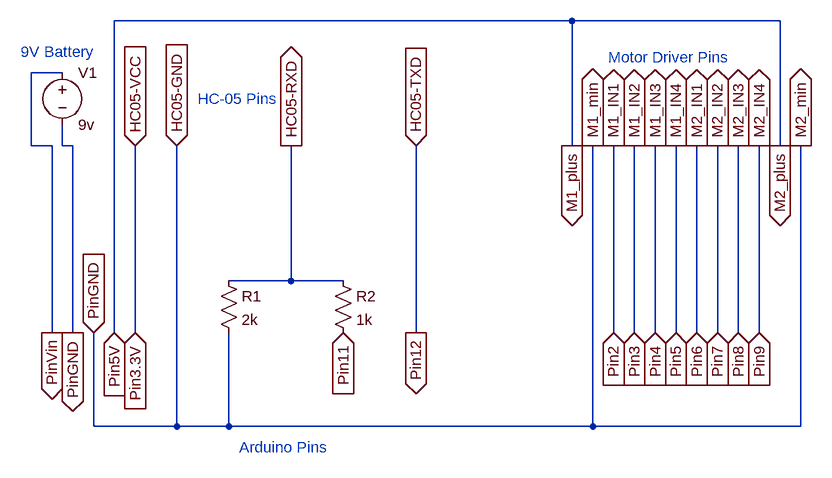
[diagram p0: schematic Schema.asc]
Schema.asc, the LTspice schematic file:
Version 4
SHEET 1 1080 680
WIRE 624 -304 -80 -304
WIRE 944 -304 624 -304
WIRE -160 -224 -208 -224
WIRE -208 -112 -208 -224
WIRE -176 -112 -208 -112
WIRE -160 -112 -160 -144
WIRE -144 -112 -160 -112
WIRE 624 -112 624 -304
WIRE 944 -112 944 -304
WIRE 192 96 192 -112
WIRE 192 96 96 96
WIRE 272 96 192 96
WIRE -176 176 -176 -112
WIRE -144 176 -144 -112
WIRE -80 176 -80 -304
WIRE -48 176 -48 -112
WIRE 384 176 384 -112
WIRE 688 176 688 -112
WIRE 720 176 720 -112
WIRE 752 176 752 -112
WIRE 784 176 784 -112
WIRE 816 176 816 -112
WIRE 848 176 848 -112
WIRE 880 176 880 -112
WIRE 912 176 912 -112
WIRE -112 320 -112 176
WIRE 16 320 16 -112
WIRE 16 320 -112 320
WIRE 96 320 96 176
WIRE 96 320 16 320
WIRE 656 320 656 -112
WIRE 656 320 96 320
WIRE 976 320 976 -112
WIRE 976 320 656 320
FLAG 272 176 Pin11
IOPIN 272 176 In
FLAG 192 -112 HC05-RXD
IOPIN 192 -112 Out
FLAG 384 -112 HC05-TXD
IOPIN 384 -112 In
FLAG 384 176 Pin12
IOPIN 384 176 Out
FLAG -48 -112 HC05-VCC
IOPIN -48 -112 In
FLAG 16 -112 HC05-GND
IOPIN 16 -112 In
FLAG -48 176 Pin3.3V
IOPIN -48 176 In
FLAG -80 176 Pin5V
IOPIN -80 176 In
FLAG 624 -112 M1_plus
IOPIN 624 -112 Out
FLAG 944 -112 M2_plus
IOPIN 944 -112 Out
FLAG 976 -112 M2_min
IOPIN 976 -112 Out
FLAG 656 -112 M1_min
IOPIN 656 -112 Out
FLAG 688 -112 M1_IN1
IOPIN 688 -112 Out
FLAG 720 -112 M1_IN2
IOPIN 720 -112 Out
FLAG 752 -112 M1_IN3
IOPIN 752 -112 Out
FLAG 784 -112 M1_IN4
IOPIN 784 -112 Out
FLAG 688 176 Pin2
IOPIN 688 176 In
FLAG 720 176 Pin3
IOPIN 720 176 In
FLAG 752 176 Pin4
IOPIN 752 176 In
FLAG 784 176 Pin5
IOPIN 784 176 In
FLAG 816 176 Pin6
IOPIN 816 176 In
FLAG 848 176 Pin7
IOPIN 848 176 In
FLAG 880 176 Pin8
IOPIN 880 176 In
FLAG 912 176 Pin9
IOPIN 912 176 In
FLAG 816 -112 M2_IN1
IOPIN 816 -112 Out
FLAG 848 -112 M2_IN2
IOPIN 848 -112 Out
FLAG 880 -112 M2_IN3
IOPIN 880 -112 Out
FLAG 912 -112 M2_IN4
IOPIN 912 -112 Out
FLAG -144 176 PinGND
IOPIN -144 176 Out
FLAG -112 176 PinGND
IOPIN -112 176 In
FLAG -176 176 PinVin
IOPIN -176 176 Out
SYMBOL res 80 80 R0
SYMATTR InstName R1
SYMATTR Value 2k
SYMBOL res 256 80 R0
SYMATTR InstName R2
SYMATTR Value 1k
SYMBOL voltage -160 -240 R0
WINDOW 123 0 0 Left 0
WINDOW 39 0 0 Left 0
SYMATTR InstName V1
SYMATTR Value 9v
TEXT -224 -256 Left 2 ;9V Battery
TEXT 112 352 Left 2 ;Arduino Pins
TEXT 48 -184 Left 2 ;HC-05 Pins
TEXT 680 -248 Left 2 ;Motor Driver Pins

The netlist it stands for:
* Schema.asc
R1 HC05-RXD PinGND 2k
R2 HC05-RXD Pin11 1k
V1 PinVin PinGND 9v
* 9V Battery
* Arduino Pins
* HC-05 Pins
* Motor Driver Pins
.backanno
.end